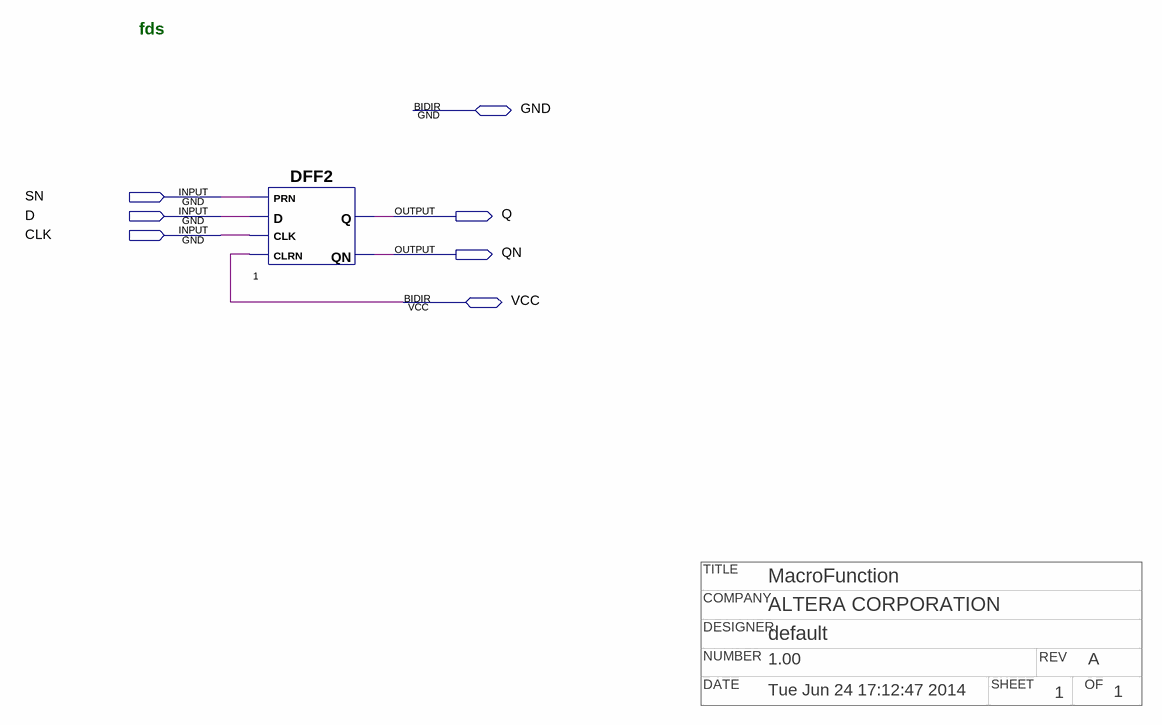
[diagram p0: schematic sheet]
// Quartus schematic npfds.bdf as structural Verilog: 1 symbols, 7 pins
// Title block: TITLE: MacroFunction; COMPANY: ALTERA CORPORATION; DESIGNER: default; NUMBER: 1.00; REV: A; DATE: Tue Jun 24 17:12:47 2014; SHEET: 1; OF: 1
module npfds (
  input  SN,
  input  D,
  input  CLK,
  inout  GND,
  inout  VCC,
  output Q,
  output QN
);

  DFF2 u_1 (.CLK(CLK), .D(D), .PRN(SN), .CLRN(VCC), .Q(Q), .QN(QN));

  // Notes on the sheet:
  //   fds
endmodule
